# EAGLE design PI_Shield (EAGLE 9.6.2)

## Sheet 1 of 3
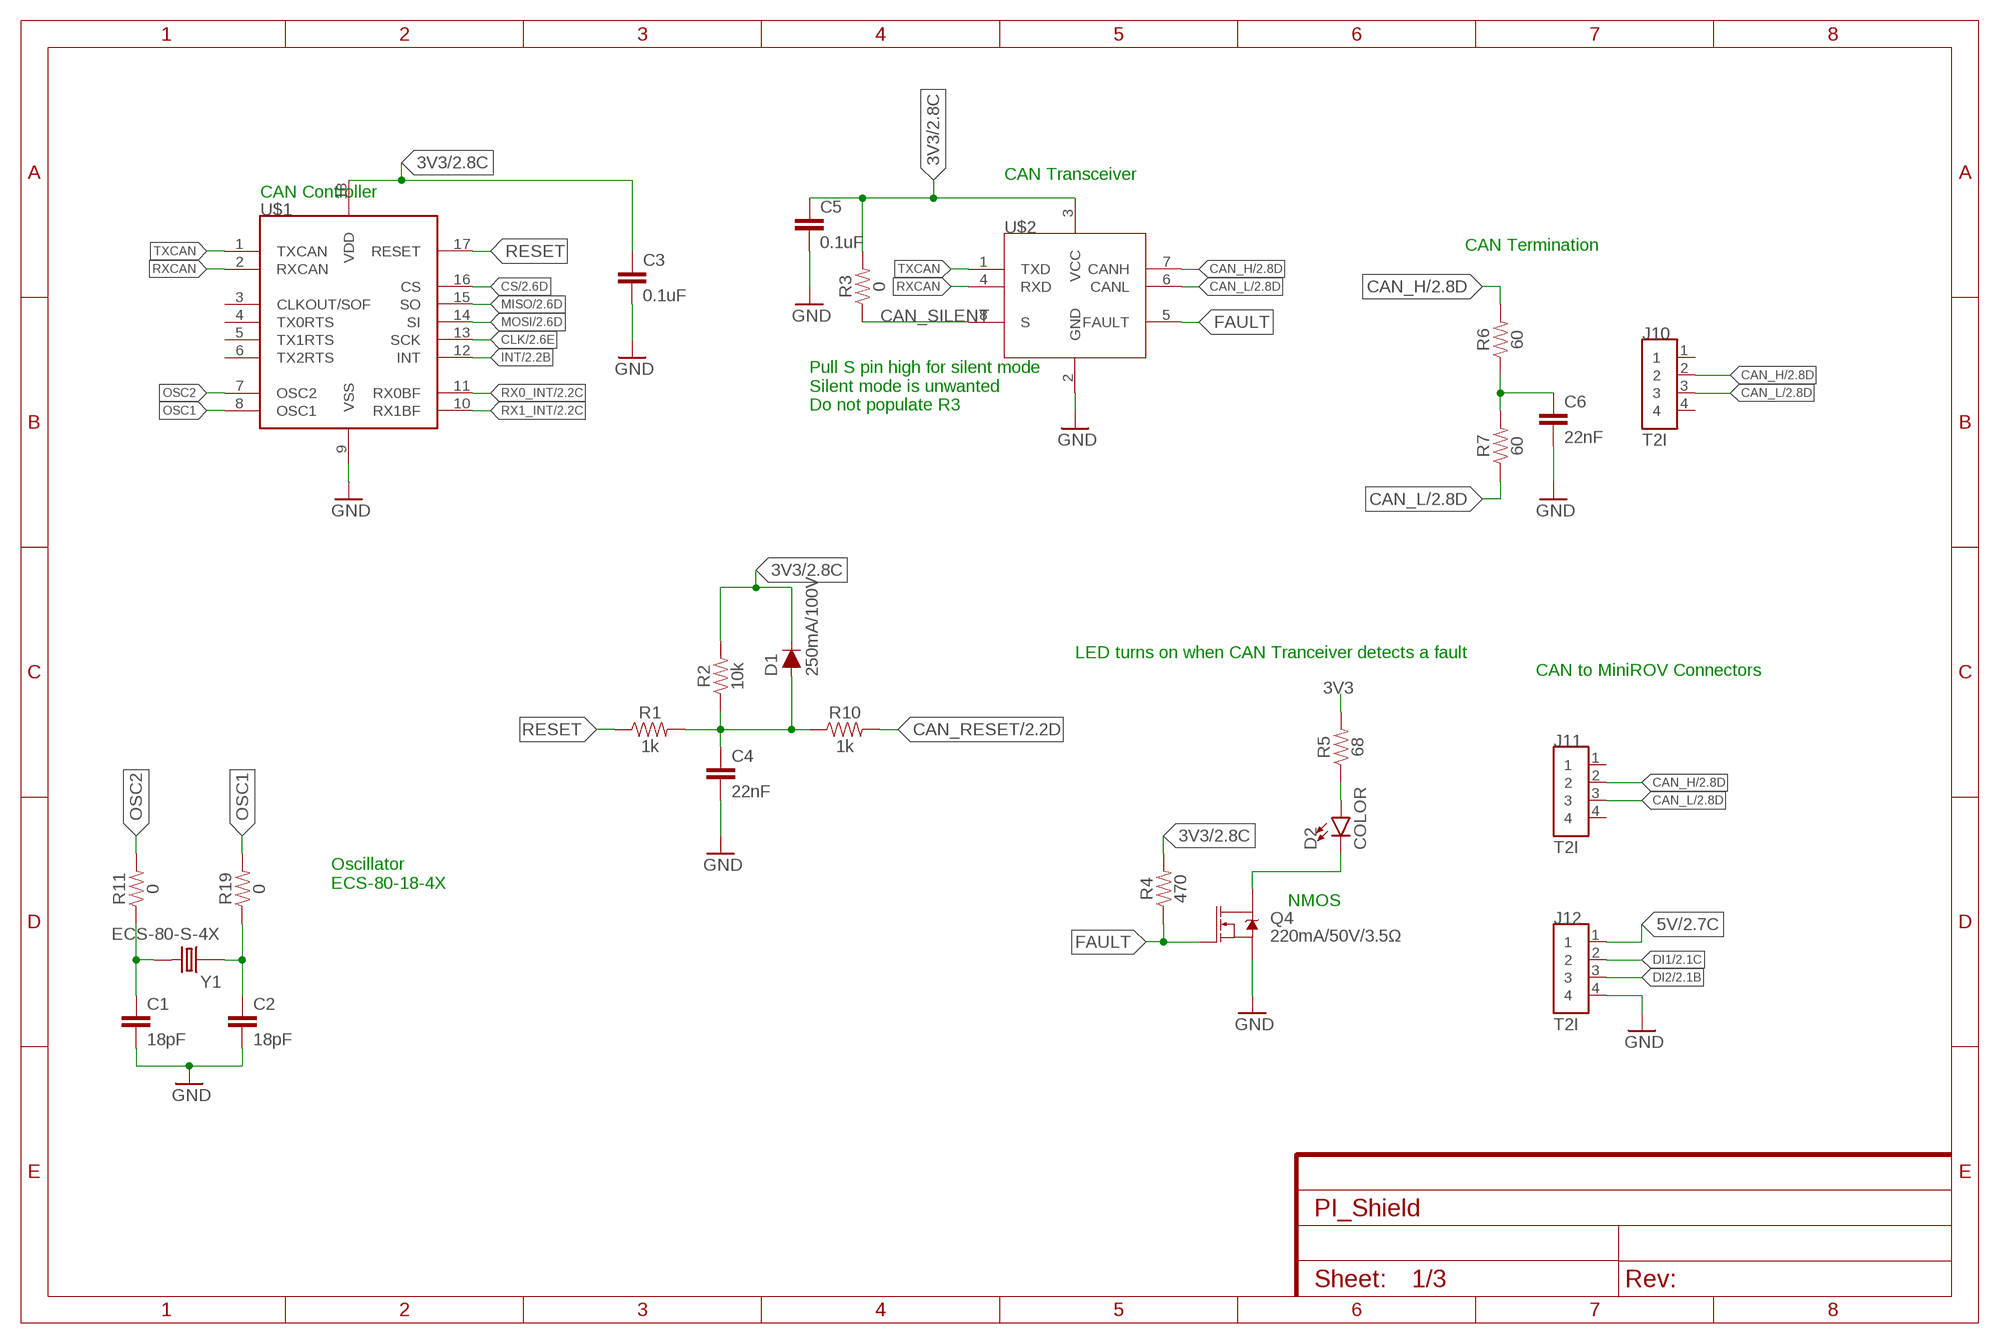
[diagram p0: schematic, sheet 1]

### Parts
C1  18pF  18PF-0603-50V-5%  [0603]
C2  18pF  18PF-0603-50V-5%  [0603]
C3  0.1uF  22NF/22,000PF-0603-50V-10%  [0603]
C4  22nF  22NF/22,000PF-0603-50V-10%  [0603]
C5  0.1uF  22NF/22,000PF-0603-50V-10%  [0603]
C6  22nF  22NF/22,000PF-0603-50V-10%  [0603]
D1  250mA/100V  DIODE-BAS16J  [SOD-323]
D2  COLOR  LED-0805  [0805]
J10  T2I  [T2I]
J11  T2I  [T2I]
J12  T2I  [T2I]
Q4  220mA/50V/3.5Ω  MOSFET-NCH-BSS138  [SOT23-3]
R1  1k  RESISTOR0603  [0603]
R2  10k  RESISTOR0603  [0603]
R3  0  RESISTOR0603  [0603]
R4  470  RESISTOR0603  [0603]
R5  68  RESISTOR0603  [0603]
R6  60  RESISTOR0603  [0603]
R7  60  RESISTOR0603  [0603]
R10  1k  RESISTOR0603  [0603]
R11  0  RESISTOR0603  [0603]
R19  0  RESISTOR0603  [0603]
U$1  MCP2515  [SOIC-18]
U$2  TCAN337D  [SOIC-8]
Y1  ECS-80-S-4X  [XTAL_ECS-80-S-4X]

### Nets
3V3 [3.3V]: C3.1 C5.1 D1.C R2.2 R3.2 R4.2 R5.2 U$1.18(VDD) U$2.3(VCC) ; also sheet 2,3
5V [5V]: J12.1 ; also sheet 2,3
CAN_H [diff pair]: J10.2 J11.2 R6.2 U$2.7(CANH) ; also sheet 2
CAN_L [diff pair]: J10.3 J11.3 R7.1 U$2.6(CANL) ; also sheet 2
CAN_RESET: R10.2 ; also sheet 2
CAN_SILENT: R3.1 U$2.8(S)
CAN_TERM_COM: C6.1 R6.1 R7.2
CLK: U$1.13(SCK) ; also sheet 2
CS: U$1.16(CS) ; also sheet 2
DI1: J12.2 ; also sheet 2
DI2: J12.3 ; also sheet 2
FAULT: Q4.1(G) R4.1 U$2.5(FAULT)
GND: C1.2 C2.2 C3.2 C4.2 C5.2 C6.2 J12.4 Q4.2(S) U$1.9(VSS) U$2.2(GND) ; also sheet 2,3
INT: U$1.12(INT) ; also sheet 2
MISO: U$1.15(SO) ; also sheet 2
MOSI: U$1.14(SI) ; also sheet 2
N$2: C1.1 R11.1 Y1.2
N$3: C2.1 R19.1 Y1.1
N$7: D2.C Q4.3(D)
N$8: D2.A R5.1
OSC1: R19.2 U$1.8(OSC1)
OSC2: R11.2 U$1.7(OSC2)
RESET: R1.1 U$1.17(RESET)
RESET_MID: C4.1 D1.A R1.2 R2.1 R10.1
RX0_INT: U$1.11(RX0BF) ; also sheet 2
RX1_INT: U$1.10(RX1BF) ; also sheet 2
RXCAN: U$1.2(RXCAN) U$2.4(RXD)
TXCAN: U$1.1(TXCAN) U$2.1(TXD)
Unconnected: J10.1 J10.4 J11.1 J11.4 U$1.3(CLKOUT/SOF) U$1.4(TX0RTS) U$1.5(TX1RTS) U$1.6(TX2RTS)

### Notes on the sheet
- CAN Transceiver
- CAN Controller
- CAN Termination
- Pull S pin high for silent mode
  Silent mode is unwanted
  Do not populate R3
- LED turns on when CAN Tranceiver detects a fault
- CAN to MiniROV Connectors
- Oscillator
  ECS-80-18-4X
- NMOS

## Sheet 2 of 3
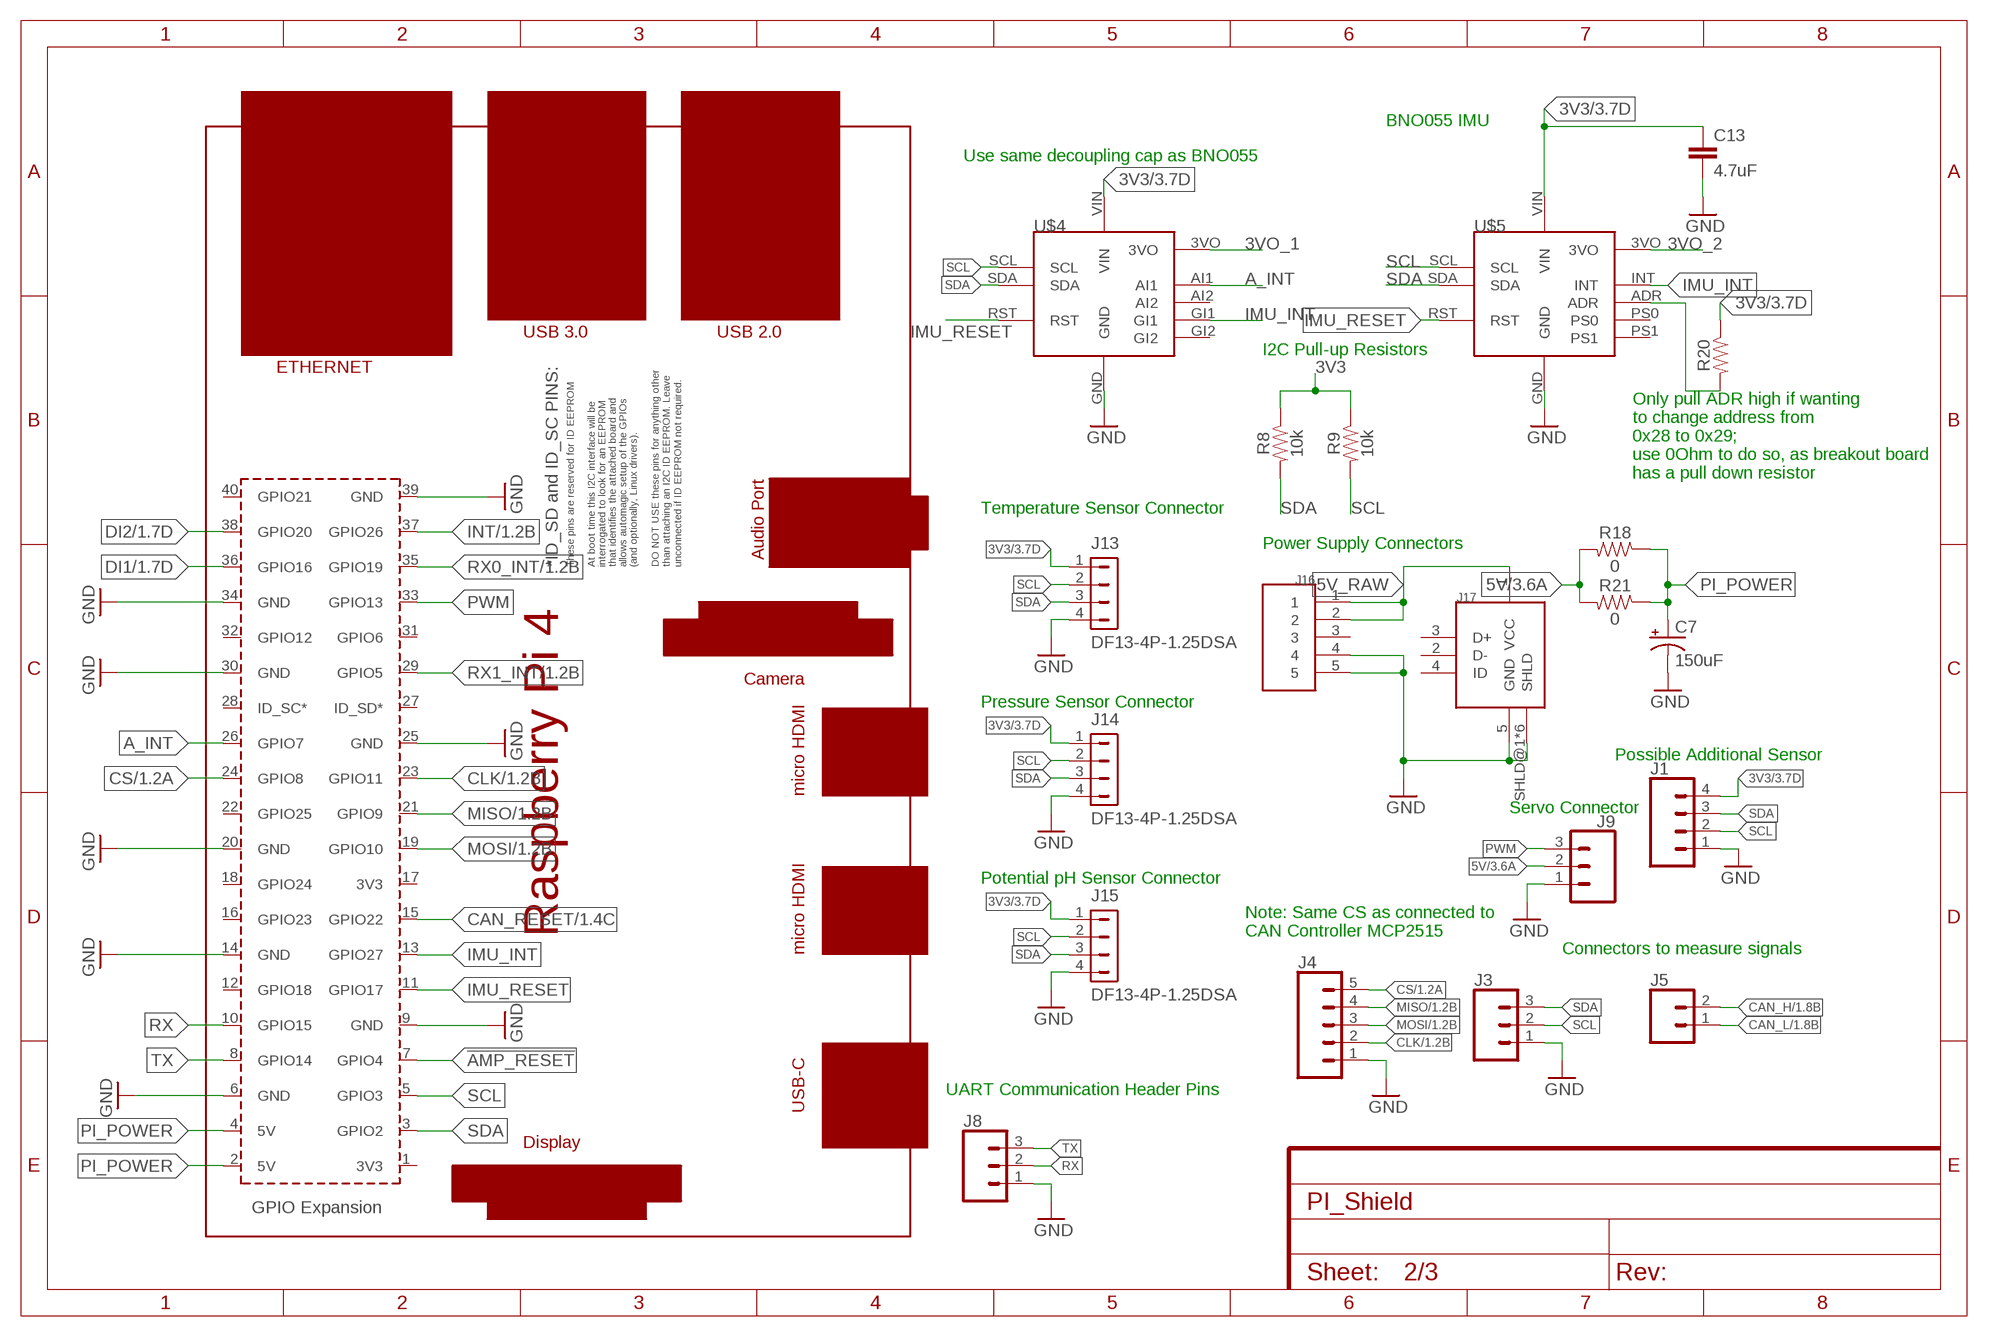
[diagram p1: schematic, sheet 2]

### Parts
C7  150uF  C-TANTALUM(10UF_150UF)  [2917(7343-31-METRIC)]
C13  4.7uF  22NF/22,000PF-0603-50V-10%  [0603]
J1  CONN_04  [1X04]
J3  CONN_03  [1X03]
J4  CONN_05  [1X05]
J5  CONN_02  [1X02]
J8  CONN_03  [1X03]
J9  CONN_03  [1X03]
J13  DF13-4P-1.25DSA  [DF13-4P-1.25DSA]
J14  DF13-4P-1.25DSA  [DF13-4P-1.25DSA]
J15  DF13-4P-1.25DSA  [DF13-4P-1.25DSA]
J16  T2I5P  [T2I5P]
J17  USB-MICRO  [MICRO-USB]
R8  10k  RESISTOR0603  [0603]
R9  10k  RESISTOR0603  [0603]
R18  0  RESISTOR0603  [0603]
R20  RESISTOR0603  [0603]
R21  0  RESISTOR0603  [0603]
U$4  ADAFRUIT-FXOS8700-FXAS21002  [ADAFRUIT-FXOS8700-FXAS21002]
U$5  ADAFRUIT-BNO055  [ADAFRUIT-BNO055]
U$8  RPI4  [RPI4]

### Nets
3V3 [3.3V]: C13.1 J1.4 J13.1 J14.1 J15.1 R8.1 R9.1 R20.1 U$4.VIN U$5.VIN ; also sheet 1,3
3VO_1: U$4.3VO
3VO_2: U$5.3VO
5V [5V]: J9.2 R18.2 R21.2 ; also sheet 1,3
5V_RAW: J16.1 J16.2 J17.1(VCC) ; also sheet 3
!AMP_RESET: U$8.7(GPIO4) ; also sheet 3
A_INT: U$4.AI1 U$8.26(GPIO7)
CAN_H [diff pair]: J5.2 ; also sheet 1
CAN_L [diff pair]: J5.1 ; also sheet 1
CAN_RESET: U$8.15(GPIO22) ; also sheet 1
CLK: J4.2 U$8.23(GPIO11) ; also sheet 1
CS: J4.5 U$8.24(GPIO8) ; also sheet 1
DI1: U$8.36(GPIO16) ; also sheet 1
DI2: U$8.38(GPIO20) ; also sheet 1
GND: C7.- C13.2 J1.1 J3.1 J4.1 J8.1 J9.1 J13.4 J14.4 J15.4 J16.4 J16.5 J17.5(GND) J17.SHLD@1(SHLD) J17.SHLD@2(SHLD) J17.SHLD@3(SHLD) J17.SHLD@4(SHLD) J17.SHLD@5(SHLD) J17.SHLD@6(SHLD) U$4.GND U$5.GND U$8.6(GND) U$8.9(GND) U$8.14(GND) U$8.20(GND) U$8.25(GND) U$8.30(GND) U$8.34(GND) U$8.39(GND) ; also sheet 1,3
IMU_INT: U$4.GI1 U$5.INT U$8.13(GPIO27)
IMU_RESET: U$4.RST U$5.RST U$8.11(GPIO17)
INT: U$8.37(GPIO26) ; also sheet 1
MISO: J4.4 U$8.21(GPIO9) ; also sheet 1
MOSI: J4.3 U$8.19(GPIO10) ; also sheet 1
N$1: R20.2 U$5.ADR
PI_POWER: C7.+ R18.1 R21.1 U$8.2(5V) U$8.4(5V)
PWM: J9.3 U$8.33(GPIO13)
RX: J8.2 U$8.10(GPIO15)
RX0_INT: U$8.35(GPIO19) ; also sheet 1
RX1_INT: U$8.29(GPIO5) ; also sheet 1
SCL: J1.2 J3.2 J13.2 J14.2 J15.2 R9.2 U$4.SCL U$5.SCL U$8.5(GPIO3) ; also sheet 3
SDA: J1.3 J3.3 J13.3 J14.3 J15.3 R8.2 U$4.SDA U$5.SDA U$8.3(GPIO2) ; also sheet 3
TX: J8.3 U$8.8(GPIO14)
Unconnected: J16.3 J17.2(D-) J17.3(D+) J17.4(ID) U$4.AI2 U$4.GI2 U$5.PS0 U$5.PS1 U$8.1(3V3) U$8.12(GPIO18) U$8.16(GPIO23) U$8.17(3V3) U$8.18(GPIO24) U$8.22(GPIO25) U$8.27(ID_SD*) U$8.28(ID_SC*) U$8.31(GPIO6) U$8.32(GPIO12) U$8.40(GPIO21)

### Notes on the sheet
- BNO055 IMU
- Use same decoupling cap as BNO055
- I2C Pull-up Resistors
- Only pull ADR high if wanting
  to change address from
  0x28 to 0x29;
  use 0Ohm to do so, as breakout board
  has a pull down resistor
- Temperature Sensor Connector
- Power Supply Connectors
- Pressure Sensor Connector
- Possible Additional Sensor
- Servo Connector
- Potential pH Sensor Connector
- Note: Same CS as connected to 
  CAN Controller MCP2515
- Connectors to measure signals
- UART Communication Header Pins

## Sheet 3 of 3
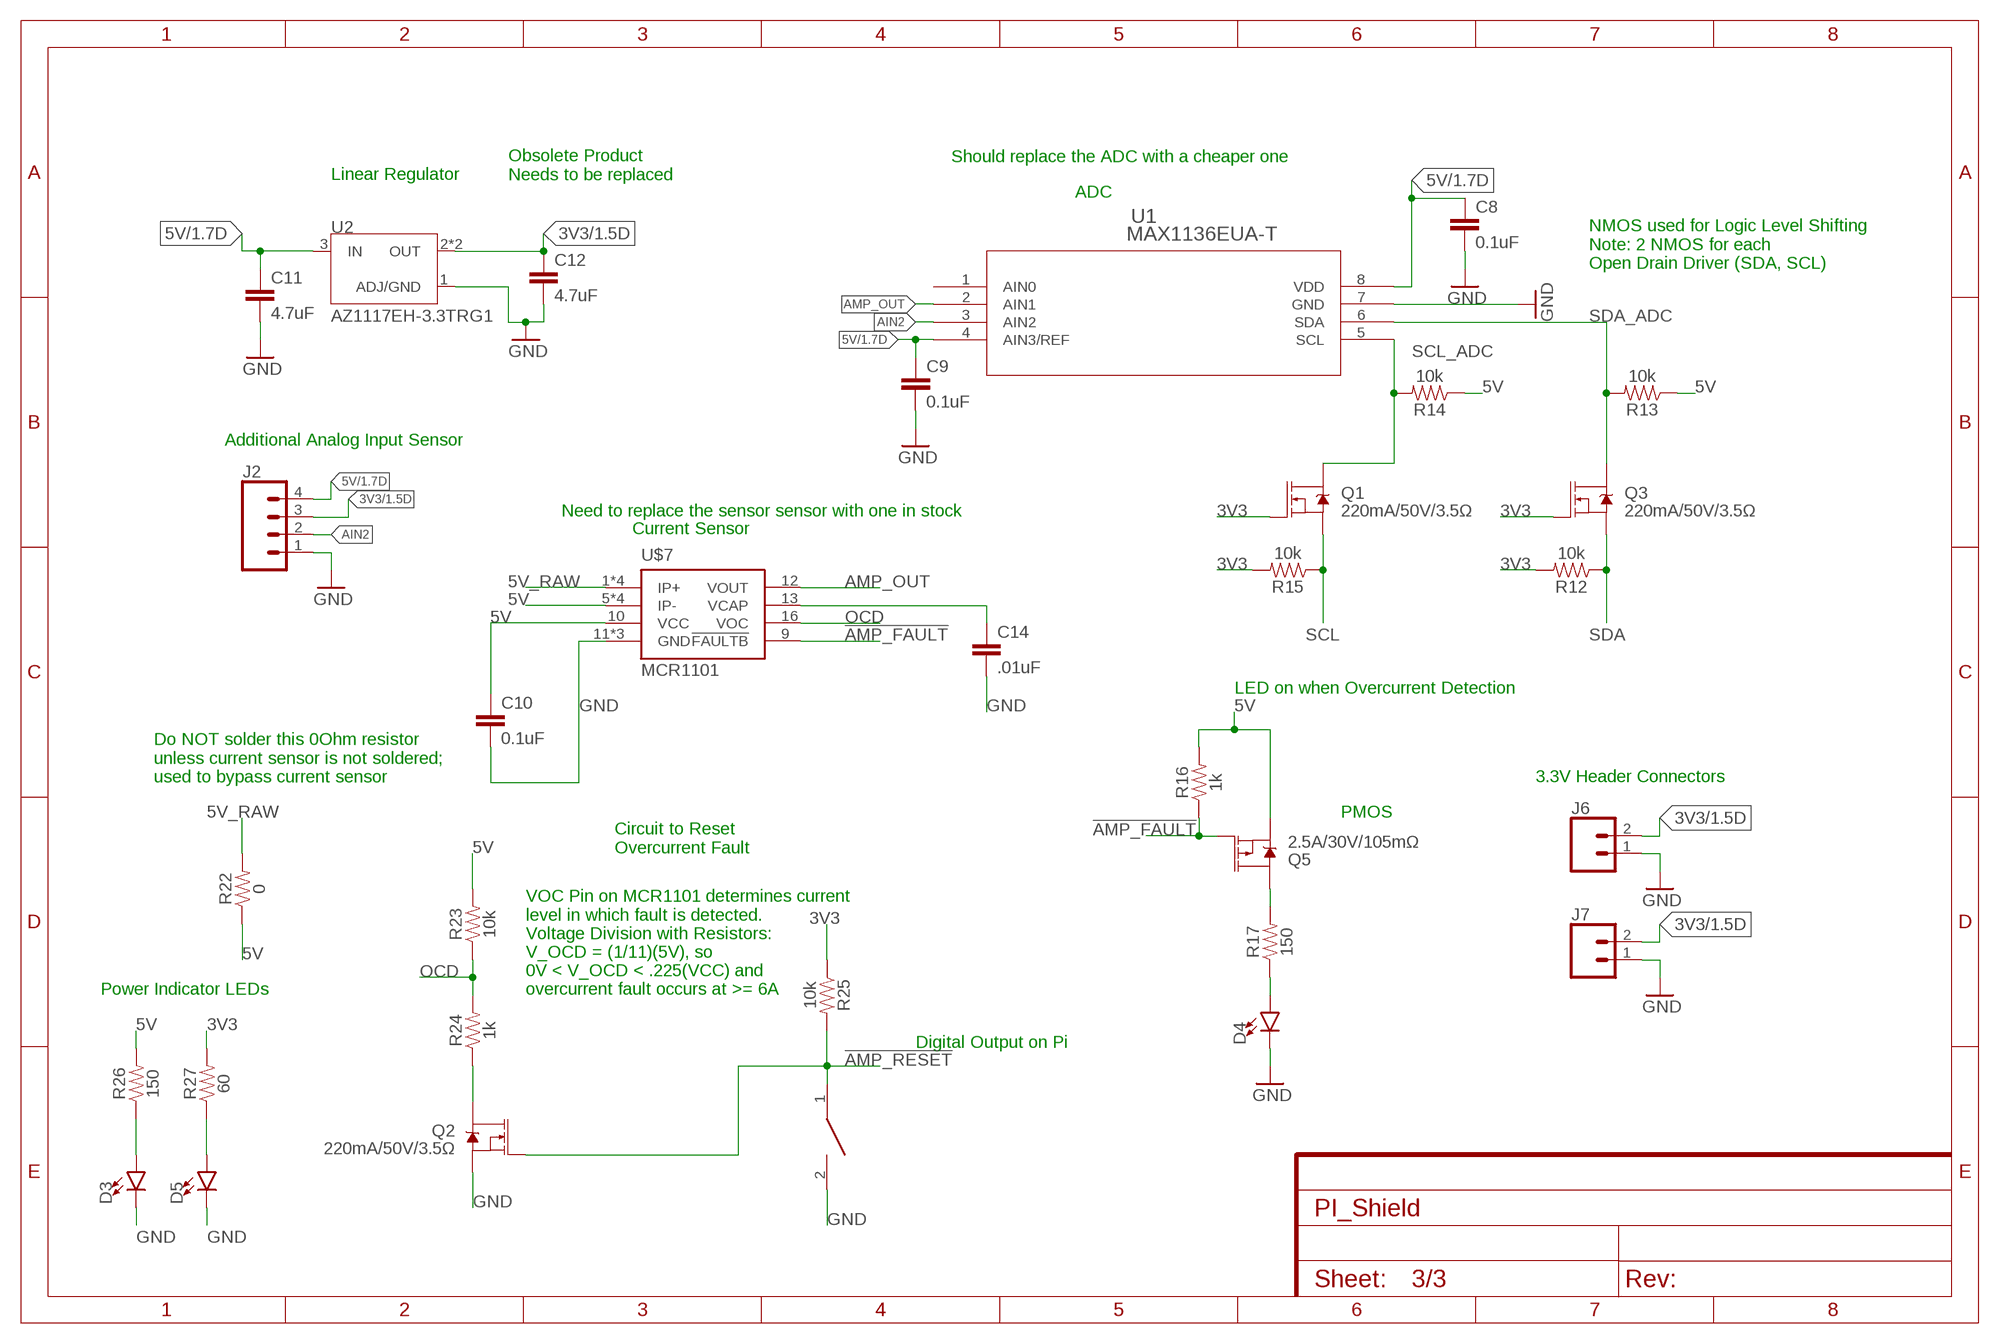
[diagram p2: schematic, sheet 3]

### Parts
C8  0.1uF  22NF/22,000PF-0603-50V-10%  [0603]
C9  0.1uF  22NF/22,000PF-0603-50V-10%  [0603]
C10  0.1uF  22NF/22,000PF-0603-50V-10%  [0603]
C11  4.7uF  22NF/22,000PF-0603-50V-10%  [0603]
C12  4.7uF  22NF/22,000PF-0603-50V-10%  [0603]
C14  .01uF  22NF/22,000PF-0603-50V-10%  [0603]
D3  LED0603  [LED-0603]
D4  LED0603  [LED-0603]
D5  LED0603  [LED-0603]
J2  CONN_04  [1X04]
J6  CONN_02  [1X02]
J7  CONN_02  [1X02]
Q1  220mA/50V/3.5Ω  MOSFET-NCH-BSS138  [SOT23-3]
Q2  220mA/50V/3.5Ω  MOSFET-NCH-BSS138  [SOT23-3]
Q3  220mA/50V/3.5Ω  MOSFET-NCH-BSS138  [SOT23-3]
Q5  2.5A/30V/105mΩ  MOSFET_PCH-DMG2307L  [SOT23-3]
R12  10k  RESISTOR0603  [0603]
R13  10k  RESISTOR0603  [0603]
R14  10k  RESISTOR0603  [0603]
R15  10k  RESISTOR0603  [0603]
R16  1k  RESISTOR0603  [0603]
R17  150  RESISTOR0603  [0603]
R22  0  RESISTOR0603  [0603]
R23  10k  RESISTOR0603  [0603]
R24  1k  RESISTOR0603  [0603]
R25  10k  RESISTOR0603  [0603]
R26  150  RESISTOR0603  [0603]
R27  60  RESISTOR0603  [0603]
U1  MAX1136EUA-T  [21-0036K]
U2  AZ1117EH-3.3TRG1  [SOT230P700X180-4N]
U$6  DISCRETECOMPONENTS_SWITCH  [DISCRETECOMPONENTS_SW_2512]
U$7  MCR1101  [SOIC-16]

### Nets
3V3 [3.3V]: C12.1 J2.3 J6.2 J7.2 Q1.1(G) Q3.1(G) R12.2 R15.2 R25.1 R27.2 U2.2(OUT) U2.4(OUT) ; also sheet 1,2
5V [5V]: C8.1 C9.1 C10.1 C11.1 J2.4 Q5.2(S) R13.1 R14.1 R16.2 R22.1 R23.2 R26.2 U1.4(AIN3/REF) U1.8(VDD) U2.3(IN) U$7.5(IP-) U$7.6(IP-) U$7.7(IP-) U$7.8(IP-) U$7.10(VCC) ; also sheet 1,2
5V_RAW: R22.2 U$7.1(IP+) U$7.2(IP+) U$7.3(IP+) U$7.4(IP+) ; also sheet 2
!AMP_FAULT: Q5.1(G) R16.1 U$7.9(!FAULTB)
!AMP_RESET: Q2.1(G) R25.2 U$6.1 ; also sheet 2
AIN2: J2.2 U1.3(AIN2)
AMP_OUT: U1.2(AIN1) U$7.12(VOUT)
GND: C8.2 C9.2 C10.2 C11.2 C12.2 C14.2 D3.C D4.C D5.C J2.1 J6.1 J7.1 Q2.2(S) U1.7(GND) U2.1(ADJ/GND) U$6.2 U$7.11(GND) U$7.14(GND) U$7.15(GND) ; also sheet 1,2
N$6: C14.1 U$7.13(VCAP)
N$9: D3.A R26.1
N$10: Q5.3(D) R17.2
N$11: D4.A R17.1
N$12: D5.A R27.1
N$13: Q2.3(D) R24.1
OCD: R23.1 R24.2 U$7.16(VOC)
SCL: Q1.2(S) R15.1 ; also sheet 2
SCL_ADC: Q1.3(D) R14.2 U1.5(SCL)
SDA: Q3.2(S) R12.1 ; also sheet 2
SDA_ADC: Q3.3(D) R13.2 U1.6(SDA)
Unconnected: U1.1(AIN0)

### Notes on the sheet
- Should replace the ADC with a cheaper one
- Linear Regulator
- Obsolete Product
  Needs to be replaced
- ADC
- NMOS used for Logic Level Shifting
  Note: 2 NMOS for each 
  Open Drain Driver (SDA, SCL)
- Additional Analog Input Sensor
- Need to replace the sensor sensor with one in stock
- Current Sensor
- LED on when Overcurrent Detection
- Do NOT solder this 0Ohm resistor
  unless current sensor is not soldered;
  used to bypass current sensor
- 3.3V Header Connectors
- PMOS
- Circuit to Reset
  Overcurrent Fault
- Power Indicator LEDs
- VOC Pin on MCR1101 determines current
  level in which fault is detected.
  Voltage Division with Resistors:
  V_OCD = (1/11)(5V), so
  0V < V_OCD < .225(VCC) and
  overcurrent fault occurs at >= 6A
- Digital Output on Pi

## Library data of the parts
C1 C2 = SparkFun-Capacitors:18PF: 18pF ceramic capacitors A capacitor is a passive two-terminal electrical component used to store electrical energy temporarily in an electric field.; PROD_ID: CAP-08267
C3 C5 C8-C14 = SparkFun-Capacitors:22NF/22,000PF: 0.022uF/22nF/22,000pF ceramic capacitors A capacitor is a passive two-terminal electrical component used to store electrical energy temporarily in an electric field.; PROD_ID: CAP-07885; VALUE: 22nF
C4 C6 = SparkFun-Capacitors:22NF/22,000PF: 0.022uF/22nF/22,000pF ceramic capacitors A capacitor is a passive two-terminal electrical component used to store electrical energy temporarily in an electric field.; PROD_ID: CAP-07885
C7 = Tantalum Cap 150 uF - Kemet 2917 T491:C-TANTALUM(10UF_150UF)
D1 = SparkFun-DiscreteSemi:DIODE: Diode These are standard reverse protection diodes and small signal diodes. SparkFun Products: SparkFun SparkPunk Sound Kit <https://www.sparkfun.com/products/11177> SparkFun ESP8266 Thing <https://www.sparkfun.com/products/13231>; PROD_ID: DIO-09646
D2 = LED-0805:LED-0805
D3-D5 = SparkFun-LED:LED: LED (Generic) Standard schematic elements and footprints for 5mm, 3mm, 1206, and 0603 sized LEDs. Generic LEDs with no color specified.
J1 J2 = SparkFun-Connectors:CONN_04: Multi connection point. Often used as Generic Header-pin footprint for 0.1 inch spaced/style header connections On any of the 0.1 inch spaced packages, you can populate with these: Break Away Headers - Straight <https://www.sparkfun.com/products/116> (PRT-00116) Break Away Male Headers - Right Angle <https://www.sparkfun.com/products/553> (PRT-00553) Female Headers <https://www.sparkfun.com/products/115> (PRT-00115) Break Away Headers - Machine Pin <https://www.sparkfun.com/products/117> (PRT-00117) Break Away Female Headers - Swiss Machine Pin <https://www.sparkfun.com/products/743> (PRT-00743) For SCREWTERMINALS and SPRING TERMINALS visit here: Screw Terimnals on SparkFun.com <https://www.sparkfun.com/search/results?term=Screw+Terminals> (5mm/3.5mm/2.54mm spacing) This device is also useful as a general connection point to wire up your design to another part of your project. Our various solder wires solder well into these plated through hole pads. Hook-Up Wire - Assortment (Stranded, 22 AWG) <https://www.sparkfun.com/products/11375> (PRT-11375) Hook-Up Wire - Assortment (Solid Core, 22 AWG) <https://www.sparkfun.com/products/11367> (PRT-11367) View the entire wire category on our website here <https://www.sparkfun.com/categories/141> Special notes: Molex polarized connector foot print use with SKU : PRT-08231 with associated crimp pins and housings. 1MM SMD Version SKU: PRT-10208; PROD_ID: CONN-09696
J3 J8 J9 = SparkFun-Connectors:CONN_03: Multi connection point. Often used as Generic Header-pin footprint for 0.1 inch spaced/style header connections On any of the 0.1 inch spaced packages, you can populate with these: Break Away Headers - Straight <https://www.sparkfun.com/products/116> (PRT-00116) Break Away Male Headers - Right Angle <https://www.sparkfun.com/products/553> (PRT-00553) Female Headers <https://www.sparkfun.com/products/115> (PRT-00115) Break Away Headers - Machine Pin <https://www.sparkfun.com/products/117> (PRT-00117) Break Away Female Headers - Swiss Machine Pin <https://www.sparkfun.com/products/743> (PRT-00743) Stackable Header - 3 Pin (Female, 0.1") <https://www.sparkfun.com/products/13875> (PRT-13875) For SCREWTERMINALS and SPRING TERMINALS visit here: Screw Terimnals on SparkFun.com <https://www.sparkfun.com/search/results?term=Screw+Terminals> (5mm/3.5mm/2.54mm spacing) This device is also useful as a general connection point to wire up your design to another part of your project. Our various solder wires solder well into these plated through hole pads. Hook-Up Wire - Assortment (Stranded, 22 AWG) <https://www.sparkfun.com/products/11375> (PRT-11375) Hook-Up Wire - Assortment (Solid Core, 22 AWG) <https://www.sparkfun.com/products/11367> (PRT-11367) View the entire wire category on our website here <https://www.sparkfun.com/categories/141> Special notes: Molex polarized connector foot print use with SKU : PRT-08232 with associated crimp pins and housings.
J4 = SparkFun-Connectors:CONN_05: Multi connection point. Often used as Generic Header-pin footprint for 0.1 inch spaced/style header connections On any of the 0.1 inch spaced packages, you can populate with these: Break Away Headers - Straight <https://www.sparkfun.com/products/116> (PRT-00116) Break Away Male Headers - Right Angle <https://www.sparkfun.com/products/553> (PRT-00553) Female Headers <https://www.sparkfun.com/products/115> (PRT-00115) Break Away Headers - Machine Pin <https://www.sparkfun.com/products/117> (PRT-00117) Break Away Female Headers - Swiss Machine Pin <https://www.sparkfun.com/products/743> (PRT-00743) For SCREWTERMINALS and SPRING TERMINALS visit here: Screw Terimnals on SparkFun.com <https://www.sparkfun.com/search/results?term=Screw+Terminals> (5mm/3.5mm/2.54mm spacing) This device is also useful as a general connection point to wire up your design to another part of your project. Our various solder wires solder well into these plated through hole pads. Hook-Up Wire - Assortment (Stranded, 22 AWG) <https://www.sparkfun.com/products/11375> (PRT-11375) Hook-Up Wire - Assortment (Solid Core, 22 AWG) <https://www.sparkfun.com/products/11367> (PRT-11367) View the entire wire category on our website here <https://www.sparkfun.com/categories/141> Special notes: Molex polarized connector foot print use with SKU : PRT-08231 with associated crimp pins and housings. 1MM SMD Version SKU: PRT-10208
J5-J7 = SparkFun-Connectors:CONN_02: Multi connection point. Often used as Generic Header-pin footprint for 0.1 inch spaced/style header connections On any of the 0.1 inch spaced packages, you can populate with these: Break Away Headers - Straight <https://www.sparkfun.com/products/116> (PRT-00116) Break Away Male Headers - Right Angle <https://www.sparkfun.com/products/553> (PRT-00553) Female Headers <https://www.sparkfun.com/products/115> (PRT-00115) Break Away Headers - Machine Pin <https://www.sparkfun.com/products/117> (PRT-00117) Break Away Female Headers - Swiss Machine Pin <https://www.sparkfun.com/products/743> (PRT-00743) For SCREWTERMINALS and SPRING TERMINALS visit here: Screw Terimnals on SparkFun.com <https://www.sparkfun.com/search/results?term=Screw+Terminals> (5mm/3.5mm/2.54mm spacing) This device is also useful as a general connection point to wire up your design to another part of your project. Our various solder wires solder well into these plated through hole pads. Hook-Up Wire - Assortment (Stranded, 22 AWG) <https://www.sparkfun.com/products/11375> (PRT-11375) Hook-Up Wire - Assortment (Solid Core, 22 AWG) <https://www.sparkfun.com/products/11367> (PRT-11367) View the entire wire category on our website here <https://www.sparkfun.com/categories/141> Special notes: Molex polarized connector foot print use with: PRT-08233 with associated crimp pins and housings. 2.54_SCREWTERM for use with PRT-10571. 3.5mm Screw Terminal footprints for PRT-08084 5mm Screw Terminal footprints for use with PRT-08432
J10-J12 = Samtec t2i:T2I
J13-J15 = con-hirose-df13:DF13-4P-1.25: DF13-4P 1.25mm Pitch Miniature Crimping Connector.
J16 = Samtec t2i:T2I5P
J17 = usb conn:USB-MICRO: Footprint for specific microUSB connector. Manufacturer: GCT. Manufacturer Product Number: USB3075-30-A. Digikey Link: https://www.digikey.com/en/products/detail/gct/USB3075-30-A/9859705
Q1-Q4 = SparkFun-DiscreteSemi:MOSFET-NCH: N-channel MOSFETs Voltage controlled devices that allow control of high current outputs. SparkFun Products: SparkFun OpenScale <https://www.sparkfun.com/products/13261> SparkFun Digital Sandbox <https://www.sparkfun.com/products/12651> SparkFun Monster Moto Shield <https://www.sparkfun.com/products/10182> SparkFun MOSFET Power Controller <https://www.sparkfun.com/products/11214>; PROD_ID: TRANS-00830
Q5 = SparkFun-DiscreteSemi:MOSFET_PCH: P-channel MOSFETs Voltage controlled devices that allow control of high current outputs. SparkFun Products: SparkFun ESP32 Thing <https://www.sparkfun.com/products/13907> SparkFun ESP8266 Thing <https://www.sparkfun.com/products/13231>; PROD_ID: TRANS-11308
R1-R27 = SparkFun-Resistors:RESISTOR: Generic Resistor Package
U1 = MAX1136EUA-T:MAX1136EUA-T; DESCRIPTION: 2.7V to 3.6V and 4.5V to 5.5V, Low-Power, 4-/12-Channel, 2-Wire Serial 10-Bit AD; DIGI-KEY_PART_NUMBER: MAX1136EUA+-ND; DIGI-KEY_PURCHASE_URL: https://www.digikey.com/product-detail/en/maxim-integrated/MAX1136EUA-/MAX1136EUA--ND/1159953?utm_source=snapeda&utm_medium=aggregator&utm_campaign=symbol; MF: Maxim Integrated; MP: MAX1136EUA+; PACKAGE: MSOP-8 Maxim Integrated
U2 = AZ1117EH-3.3TRG1:AZ1117EH-3.3TRG1: Ldo.Vreg Pos 3, 3v 1a Sot223; AVAILABILITY: Unavailable; DESCRIPTION: Ldo.Vreg Pos 3, 3v 1a Sot223; MF: Diodes Inc.; MP: AZ1117EH-3.3TRG1; PACKAGE: SOT-223 Diodes Inc.; PRICE: None
U$1 = STM and CAN parts:MCP2515
U$2 = STM and CAN parts:TCAN337D
U$4 = Adafruit IMUs - BNO055 and FX:ADAFRUIT-FXOS8700-FXAS21002
U$5 = Adafruit IMUs - BNO055 and FX:ADAFRUIT-BNO055
U$6 = Push button - FSM2JMTR:DISCRETECOMPONENTS_SWITCH: TE Connectivity FSM2JMTR Switch
U$7 = MCR1101:MCR1101
U$8 = RaspberryPi:RPI4
Y1 = ECS-80-S-4X:ECS-80-S-4X: CRYSTAL T/H; DESCRIPTION: Crystal 8MHz Series 2-Pin HC-49/U; DIGI-KEY_PART_NUMBER: X1057-ND; DIGI-KEY_PURCHASE_URL: https://www.digikey.com/product-detail/en/ecs-inc/ECS-80-S-4X/X1057-ND/827549?utm_source=snapeda&utm_medium=aggregator&utm_campaign=symbol; MF: ECS International; MP: ECS-80-S-4X; PACKAGE: HC-49/US ECS International

## Net classes
0 default: width 0.203 mm
1 diff pair: width 0.203 mm, clearance 0.203 mm
2 5V: width 0.508 mm
3 3.3V: width 0.508 mm

## Board
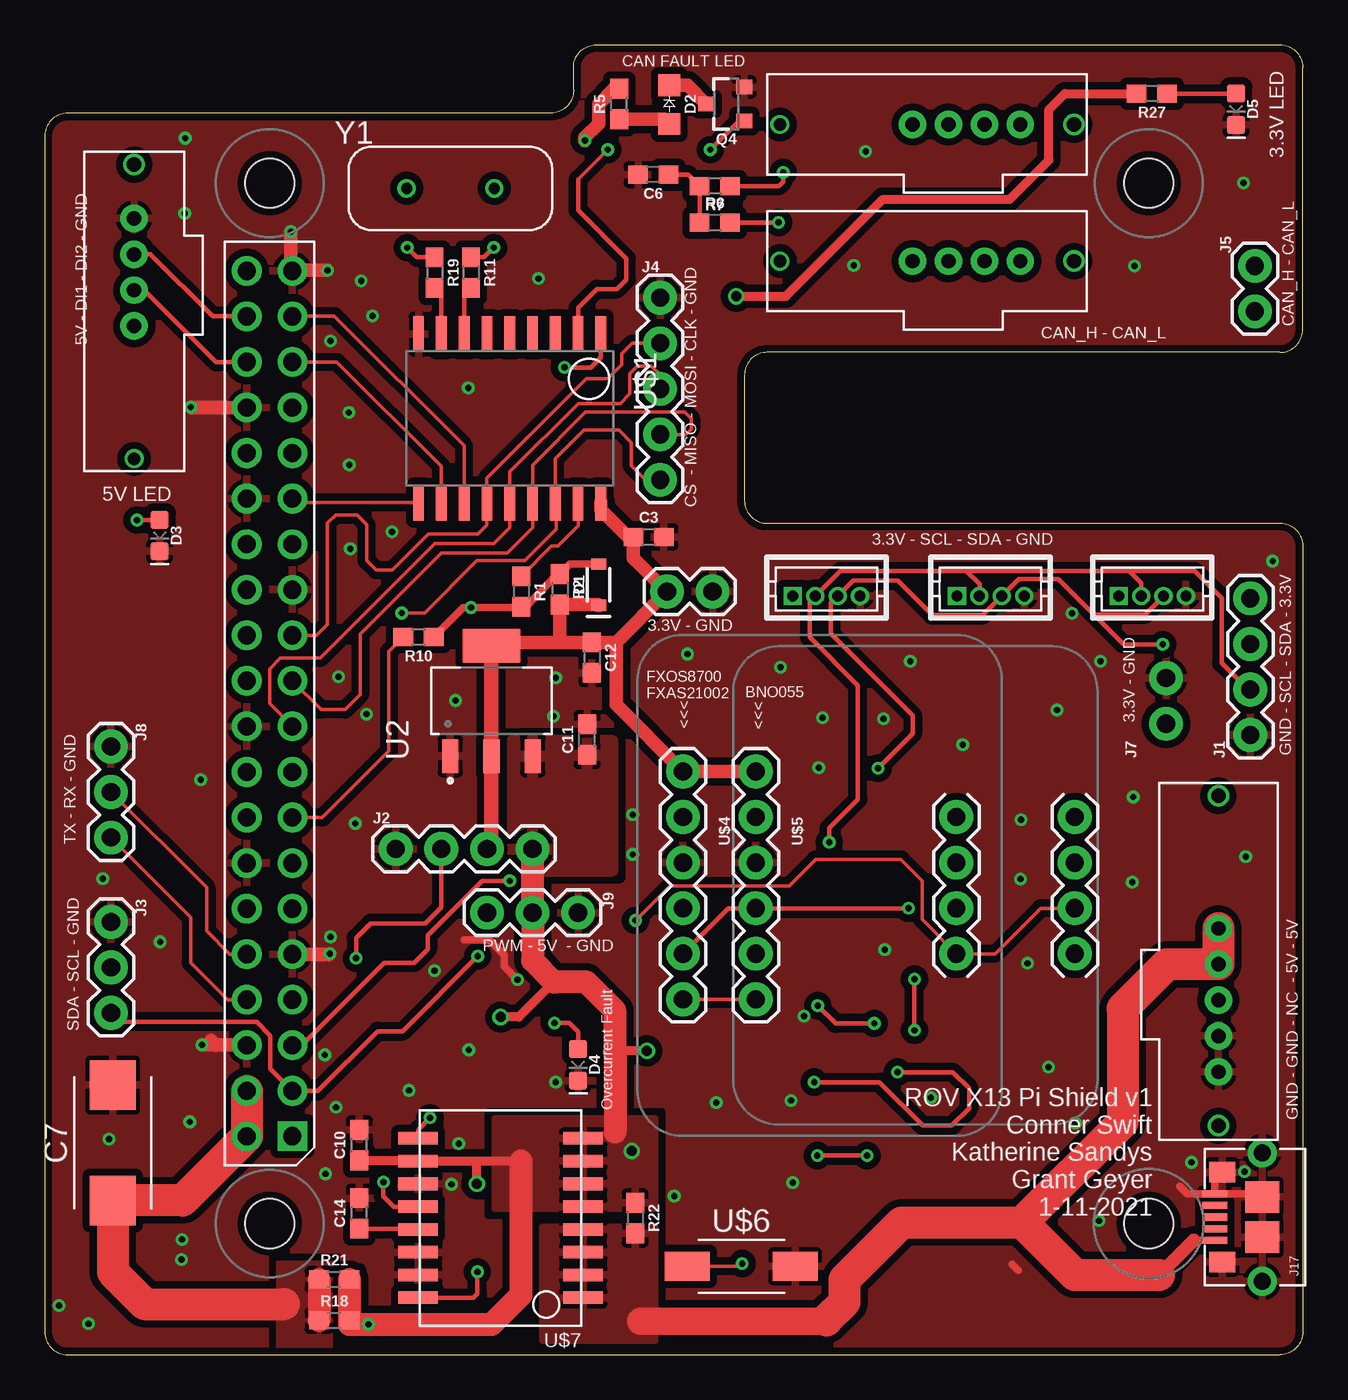
[diagram p3: board, top side]
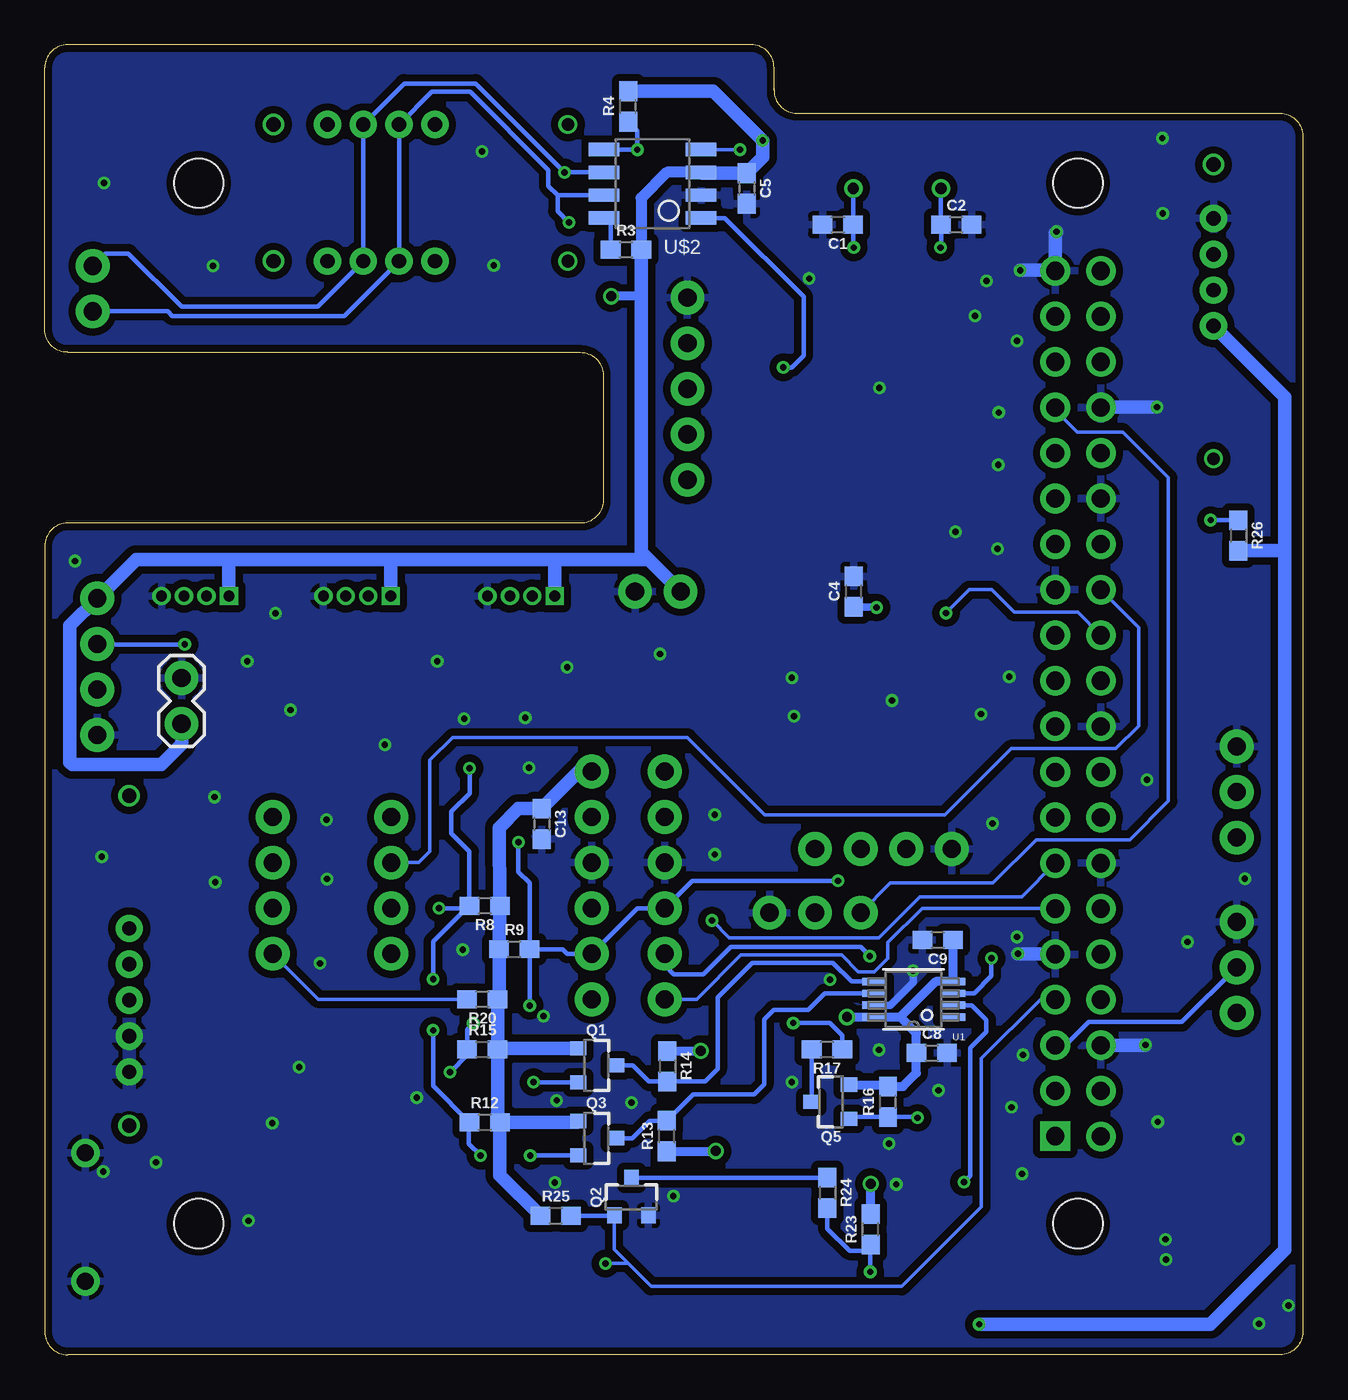
[diagram p4: board, bottom side, seen from below]

Size 70.1 x 73.03 mm. Coordinates in mm from the lower left corner, seen from the top.
Outline: 70.1,45.09 70.1,1.27 arc-90 68.83,0 1.27,0 arc-90 0,1.27 0,67.94 arc-90 1.27,69.22 28.19,69.22 arc90 29.46,70.48 29.46,71.75 arc-90 30.73,73.03 68.83,73.03 arc-90 70.1,71.75 70.1,57.15 arc-90 68.83,55.88 40.26,55.88 arc90 38.99,54.61 38.99,47.62 arc90 40.26,46.35 68.83,46.35 arc-90 70.1,45.09
Copper layers (1*16): Top 0.0356mm / dielectric 1.5011mm / Bottom 0.0356mm
Design rules "ECE477": minimum track width 8mil, minimum drill 13mil, track to track 8mil, track to pad 8mil, pad to pad 6mil, via to via 8mil, smd to smd 6mil, copper to edge 15mil, drill to drill 8mil, minimum pad ring 7mil, minimum via ring 7mil, stop-mask expansion 3mil, vias tented up to drill 0mil, thermal gap 10mil

### Footprints (pad centres in the part's own frame; a part is rotated, then mirrored left to right if it is on the bottom)
0603 = smd 1.1 x 1: 1 -0.85,0; 2 0.85,0
2917(7343-31-METRIC) = smd 2.77 x 2.55: + -3.22,0; - 3.22,0
SOD-323 = smd 0.63 x 0.83: A 1.15,0; C -1.15,0
0805 = smd 1.2 x 1.2: A 1.1,0; C -1.05,0
LED-0603 = smd 1 x 1: A -0.877,0; C 0.877,0
1X04 = drill 1.016 pad 1.88: 1 0,0; 2 2.54,0; 3 5.08,0; 4 7.62,0
1X03 = drill 1.016 pad 1.88: 1 0,0; 2 2.54,0; 3 5.08,0
1X05 = drill 1.016 pad 1.88: 1 0,0; 2 2.54,0; 3 5.08,0; 4 7.62,0; 5 10.16,0
1X02 = drill 1.016 pad 1.88: 1 0,0; 2 2.54,0
T2I = drill 0.8 pad 1.524: 1 8.1,2.8; 2 10.1,2.8; 3 12.1,2.8; 4 14.1,2.8 | drill 0.7: S1 0.7,2.8 | drill 0.8: S2 17.1,2.8
DF13-4P-1.25DSA = drill 0.6 pad 1.016 square: 1 1.875,0 | drill 0.6 pad 1.016: 2 0.625,0; 3 -0.625,0; 4 -1.875,0
T2I5P = drill 0.8 pad 1.524: 1 -11.7,3.3; 2 -9.7,3.3; 3 -7.7,3.3; 4 -5.7,3.3; 5 -3.7,3.3 | drill 0.8: P$1 -19.1,3.3; P$7 -0.7,3.3
MICRO-USB = smd 0.4 x 1.4: 1 -1.3,2.65; 2 -0.65,2.65; 3 0,2.65; 4 0.65,2.65; 5 1.3,2.65 | smd 1.75 x 1.9: SHLD@1 -1.125,0; SHLD@2 1.125,0 | drill 0.95 pad 1.6: SHLD@3 -3.575,0; SHLD@4 3.575,0 | smd 1.15 x 1.45: SHLD@5 -2.5,2.23; SHLD@6 2.5,2.23
SOT23-3 = smd 0.8 x 0.9: 1 -0.95,-1; 2 0.95,-1; 3 0,1.1
21-0036K = smd 1.372 x 0.406: 1 -2.184,0.991; 2 -2.184,0.33; 3 -2.184,-0.33; 4 -2.184,-0.991; 5 2.184,-0.991; 6 2.184,-0.33; 7 2.184,0.33; 8 2.184,0.991
SOT230P700X180-4N = smd 1.86 x 0.9: 1 -3.075,2.3; 2 -3.075,0; 3 -3.075,-2.3 | smd 1.86 x 3.19: 4 3.075,0
SOIC-18 = smd 2 x 0.6: 1 0,10.16; 2 0,8.89; 3 0,7.62; 4 0,6.35; 5 0,5.08; 6 0,3.81; 7 0,2.54; 8 0,1.27; 9 0,0; 10 9.4,0; 11 9.4,1.27; 12 9.4,2.54; 13 9.4,3.81; 14 9.4,5.08; 15 9.4,6.35; 16 9.4,7.62; 17 9.4,8.89; 18 9.4,10.16
SOIC-8 = smd 1.7 x 0.75: 1 0,3.81; 2 0,2.54; 3 0,1.27; 4 0,0; 5 5.4,0; 6 5.4,1.27; 7 5.4,2.54; 8 5.4,3.81
ADAFRUIT-FXOS8700-FXAS21002 = drill 1.016 pad 1.88: 3VO 10.16,2.54; AI1 12.7,17.78; AI2 10.16,17.78; GI1 17.78,17.78; GI2 15.24,17.78; GND 12.7,2.54; RST 20.32,2.54; SCL 15.24,2.54; SDA 17.78,2.54; VIN 7.62,2.54
ADAFRUIT-BNO055 = drill 1.016 pad 1.88: 3VO 9.525,1.27; ADR 17.145,19.05; GND 12.065,1.27; INT 14.605,19.05; PS0 9.525,19.05; PS1 12.065,19.05; RST 19.685,1.27; SCL 17.145,1.27; SDA 14.605,1.27; VIN 6.985,1.27
DISCRETECOMPONENTS_SW_2512 = smd 2.5 x 1.6: 1 -3,0; 2 3,0
SOIC-16 = smd 2.2 x 0.7: 1 -4.6,4.445; 2 -4.6,3.175; 3 -4.6,1.905; 4 -4.6,0.635; 5 -4.6,-0.635; 6 -4.6,-1.905; 7 -4.6,-3.175; 8 -4.6,-4.445; 9 4.6,-4.445; 10 4.6,-3.175; 11 4.6,-1.905; 12 4.6,-0.635; 13 4.6,0.635; 14 4.6,1.905; 15 4.6,3.175; 16 4.6,4.445
RPI4 = drill 1.016 pad 1.651 square: 1 8.37,51.23 | drill 1.016 pad 1.651: 2 8.357,53.772; 3 10.897,51.232; 4 10.897,53.772; 5 13.437,51.232; 6 13.437,53.772; 7 15.977,51.232; 8 15.977,53.772; 9 18.517,51.232; 10 18.517,53.772; 11 21.057,51.232; 12 21.057,53.772; 13 23.597,51.232; 14 23.597,53.772; 15 26.137,51.232; 16 26.137,53.772; 17 28.677,51.232; 18 28.677,53.772; 19 31.217,51.232; 20 31.217,53.772; 21 33.757,51.232; 22 33.757,53.772; 23 36.297,51.232; 24 36.297,53.772; 25 38.837,51.232; 26 38.837,53.772; 27 41.377,51.232; 28 41.377,53.772; 29 43.917,51.232; 30 43.917,53.772; 31 46.457,51.232; 32 46.457,53.772; 33 48.997,51.232; 34 48.997,53.772; 35 51.537,51.232; 36 51.537,53.772; 37 54.077,51.232; 38 54.077,53.772; 39 56.617,51.232; 40 56.617,53.772 | hole 2.75: 3.5,3.5; 61.5,3.5; 3.5,52.5; 61.5,52.5
XTAL_ECS-80-S-4X = drill 0.63 pad 1.03: 1 -2.44,0; 2 2.44,0

### Placement (x,y rotation side)
C1  25.91,62.99 180 bottom
C2  19.3,62.99 0 bottom
C3  33.66,45.59 0 top
C4  25.02,42.55 90 bottom
C5  30.99,65.02 270 bottom
C6  33.91,65.79 180 top
C7  3.78,11.81 90 top
C8  20.68,16.81 0 bottom
C9  20.35,23.11 180 bottom
C10  17.53,11.68 90 top
C11  30.23,34.29 90 top
C12  30.48,38.86 270 top
C13  42.42,29.59 270 bottom
C14  17.53,7.87 90 top
D1  30.86,42.93 90 top
D2  34.8,69.72 270 top
D3  6.4,45.67 270 top
D4  29.72,16.15 270 top
D5  66.4,69.44 270 top
J1  67.18,34.54 90 top
J2  19.56,28.19 0 top
J3  3.68,24.13 270 top
J4  34.29,58.93 270 top
J5  67.44,60.71 270 top
J6  37.21,42.55 180 top
J7  62.48,37.72 270 bottom
J8  3.68,33.91 270 top
J9  29.72,24.64 180 top
J10  40.26,65.79 0 top
J11  40.26,58.17 0 top
J12  7.77,49.25 90 top
J13  61.72,42.29 180 top
J14  43.56,42.29 180 top
J15  52.7,42.29 180 top
J16  62.1,12.06 270 top
J17  67.84,7.67 90 top
Q1  39.37,16.13 270 bottom
Q2  37.41,8.76 0 bottom
Q3  39.37,12.06 270 bottom
Q4  37.97,69.72 90 top
Q5  26.29,14.1 90 bottom
R1  26.54,42.55 270 top
R2  28.7,42.67 270 top
R3  37.72,61.59 0 bottom
R4  37.59,69.6 90 bottom
R5  32,69.72 90 top
R6  37.34,63.12 0 top
R7  37.34,65.15 180 top
R8  45.59,25.02 180 bottom
R9  43.94,22.61 0 bottom
R10  20.83,40.01 180 top
R11  23.75,60.33 270 top
R12  45.59,12.95 0 bottom
R13  35.43,12.19 90 bottom
R14  35.41,16.08 270 bottom
R15  45.72,17.02 0 bottom
R16  23.11,14.1 90 bottom
R17  26.52,17.02 180 bottom
R18  16.13,1.91 0 top
R19  21.72,60.33 270 top
R20  45.72,19.81 180 bottom
R21  16.13,4.19 0 top
R22  32.89,7.62 270 top
R23  24.08,6.99 90 bottom
R24  26.49,9.02 270 bottom
R25  41.63,7.75 0 bottom
R26  3.58,45.67 270 bottom
R27  61.7,70.31 180 top
U1  21.69,19.81 180 bottom
U2  24.89,36.45 90 top
U$1  20.83,56.9 270 top
U$2  33.53,67.18 180 bottom
U$4  33.02,40.13 270 top
U$5  38.35,39.5 270 top
U$6  38.81,4.93 0 top
U$7  25.4,7.62 180 top
U$8  65.02,3.81 90 top
Y1  22.61,65.02 0 top

### Tracks (layer width: path | path; a pad name or v marks a point on that pad's centre or on a via)
3V3  (via drill 0.35, 0.55)
  Top 0.508: v38.53,59 41.3,59 46.71,64.41 53.77,64.41 55.96,66.6 55.96,69.42 56.84,70.31 R27.2
  Top 0.762: U2.4 25.08,39.71 28.96,39.71 | 28.96,39.71 C12.1 31.84,39.71 | 28.96,39.71 28.7,39.97 R2.2 30.82,41.82 D1.C | 31.84,39.71 J6.2 32.8,44.41 C3.1 32.51,45.59 30.99,47.12 U$1.18 | 31.84,39.71 31.84,36.23 U$4.VIN U$5.VIN | v30.1,67.69 30.1,67.87 30.86,68.64 30.86,69.72 31.71,70.57 R5.2
  Top 0.813: J2.3 24.89,28.45 U2.2 U2.4
  Bottom 0.508: 36.87,59 v38.53,59
  Bottom 0.61: U$2.3 35.43,65.91 36.87,64.48 R3.2
  Bottom 0.762: J6.2 36.45,44.32 | 36.45,44.32 41.66,44.32 | 41.66,44.32 50.93,44.32 | 50.93,44.32 59.82,44.32 | J15.1 50.83,44.23 50.93,44.32 | J14.1 41.69,44.29 41.66,44.32 | 59.82,44.32 65.02,44.32 J1.4 68.71,40.64 68.71,33.02 68.58,32.89 63.63,32.89 62.48,34.04 J7.2 | J13.1 59.85,44.29 59.82,44.32 | U$5.VIN 40.35,32.51 C13.1 43.73,30.44 44.79,29.38 R8.1 R9.1 44.79,19.89 R20.1 R15.2 | Q1.1 44.81,17.08 R15.2 | R15.2 44.87,13.08 R12.2 | R12.2 40.43,12.95 Q3.1 | R12.2 44.74,10.01 R25.1 | U$2.3 33.49,65.87 C5.1 30.1,66.76 v30.1,67.69 32.85,70.45 R4.2 | R3.2 36.87,59 36.87,58.22 36.87,44.74 36.45,44.32
5V  (via drill 0.35, 0.55)
  Top 0.508: C10.1 20.76,10.83 U$7.10 24.08,10.79 | v33.55,16.94 31.8,16.94 31.75,16.89 | v24.08,9.53 24.08,10.79 | 24.08,10.79 26.54,10.79 | 28.45,20.78 28.37,20.78 26.42,18.82 v25.4,18.82
  Top 1.27: 28.45,20.78 30.18,20.78 31.75,19.2 31.75,16.89 | J2.4 J9.2 27.18,21.97 28.37,20.78 | R21.2 R18.2 16.98,1.69 v18.03,1.69 24.91,1.69 26.54,3.33 26.54,10.79 | 31.8,16.94 31.78,16.94 31.78,12.42
  Bottom 0.508: Q5.2 23.21,15.05 R16.2 22.29,14.95 21.53,15.71 C8.1 21.53,17.92 22.43,18.82 | 22.43,18.82 U1.8 v25.4,18.82 | R14.1 33.57,16.93 v33.55,16.94 | R13.1 32.73,11.34 v32.71,11.35 | 22.43,18.82 20.45,20.8 U1.4 19.5,20.81 C9.1 | R23.2 v24.08,9.53
  Bottom 0.762: v18.03,1.69 5.17,1.69 1.02,5.84 1.02,44.82 | J12.1 2.32,54.7 1.02,53.39 1.02,44.82 | R26.2 1.02,44.82
  pour Top: 25.1,8.15 25.1,13.16 33.99,13.16 33.99,8.15
  pour Top: 31.67,34.24 26.04,34.24 26.04,27.46 26.04,26.97 29.77,26.97 31.67,26.97
5V_RAW
  Top 0.406: 50.44,7.34 50.42,7.37 | J17.1 64.03,6.37
  Top 0.762: 62.1,4.45 64.03,6.37
  Top 1.524: 43.56,1.91 43.56,1.85 33.22,1.85
  Top 1.778: J16.1 J16.2 62.53,21.77 60.07,19.3 60.07,12.95 54.48,7.37 | 43.56,1.91 44.58,2.92 44.58,4.19 47.75,7.37 50.42,7.37 54.48,7.37 | 62.1,4.45 57.4,4.45 54.48,7.37
  pour Top: 27.76,7.11 27.76,0.81 33.99,0.81 33.99,7.11
!AMP_FAULT  (via drill 0.35)
  Top 0.254: v21.46,13.21 20.8,12.54 U$7.9
  Bottom 0.254: v21.46,13.21 21.5,13.25 R16.1 23.13,13.26 25.18,13.26 Q5.1
!AMP_RESET  (via drill 0.35)
  Top 0.203: v38.86,5.08 38.71,4.93 U$6.1
  Bottom 0.203: U$8.7 14.63,19.79 17.91,16.51 17.91,8.26 22.35,3.81 36.32,3.81 37.59,5.08 | 38.38,7.75 38.38,5.87 37.59,5.08 | 37.59,5.08 v38.86,5.08
  Bottom 0.254: R25.2 38.38,7.75 Q2.1
A_INT
  Bottom 0.203: U$8.26 9.14,40.54 9.14,35.05 10.41,33.78 16.26,33.78 19.94,30.1 29.97,30.1 34.29,34.42 47.37,34.42 48.64,33.15 48.64,28.07 49.28,27.43 U$4.AI1
AIN2  (via drill 0.35)
  Top 0.254: J2.2 22.1,24.94 21.21,24.05 18.16,24.05 17.35,23.24 v17.35,22.1
  Bottom 0.254: v17.35,22.1 17.35,21.11 18.31,20.14 U1.3
AMP_OUT  (via drill 0.35)
  Top 0.254: U$7.12 19.43,8.26 18.85,8.84 18.85,9.6 v18.87,9.63
  Bottom 0.254: v18.87,9.63 18.54,9.96 18.54,17.09 17.63,18.01 17.63,18.67 18.44,19.48 U1.2
CAN_H  (via drill 0.35)
  Top 0.254: v40.89,63.12 R6.2
  Bottom 0.254: J5.2 63.25,58.17 62.99,57.91 53.41,57.91 J11.2 J10.2 48.54,70.41 46.41,70.41 42.04,66.04 42.04,65.15 41.53,64.64 | 41.53,64.64 U$2.7 | v40.89,63.12 41.53,63.75 41.53,64.64
CAN_L  (via drill 0.35)
  Top 0.254: v41.15,65.91 41.15,65.41 40.89,65.15 R7.1
  Bottom 0.254: U$2.6 v41.15,65.91 46.1,70.87 50.08,70.87 J10.3 J11.3 54.91,58.42 62.48,58.42 65.46,61.39 66.75,61.39 J5.1
CAN_RESET
  Top 0.203: R10.2 19.18,39.2 19.18,33.66 15.47,29.95 U$8.15
CAN_SILENT
  Bottom 0.254: U$2.8 38.57,63.01 R3.1
CAN_TERM_COM
  Top 0.203: 36.61,65.02 36.53,65.11 R7.2
  Top 0.254: C6.1 35.85,65.79 36.53,65.11 | 36.61,65.02 R7.2 R6.1
CLK
  Top 0.203: U$8.23 15.14,40.11 15.75,40.72 15.75,46.35 16.21,46.81 17.4,46.81 17.93,46.28 17.93,44.27 18.47,43.74 19.36,43.74 21.36,45.74 24.13,45.74 24.64,46.25 U$1.13 24.64,48.87 30.18,54.41 31.37,54.41 32.16,55.19 32.16,55.8 32.74,56.39 J4.2
CS  (via drill 0.35)
  Top 0.203: v19.89,41.35 21.16,41.35 24.08,44.27 26.74,44.27 28.49,46.02 28.49,47.45 U$1.16 28.45,49.96 30.02,51.54 32,51.54 32.69,50.85 32.69,49.58 33.5,48.77 J4.5
  Bottom 0.203: v19.89,41.35 18.59,42.65 17.32,42.65 16.08,41.4 12.55,41.4 U$8.24
DI1
  Top 0.254: U$8.36 9.55,55.35 5.54,59.36 J12.2
DI2
  Top 0.254: U$8.38 9.35,57.89 5.87,61.37 4.99,61.37 J12.3
FAULT  (via drill 0.35)
  Top 0.254: v37.08,67.18 38.67,68.77 Q4.1
  Bottom 0.254: U$2.5 v37.08,67.18 37.08,68.24 R4.1
GND  (via drill 0.35)
  Top 0.406: 23.37,23.11 24.77,23.11 25.6,22.28 25.6,21.64 v26.34,20.9 | 53.9,5.04 54.24,4.7 | J17.5 63.67,8.97 63.25,9.4 | J17.5 65.19,9.75 J17.SHLD@6 | J17.5 67.67,8.97 J17.SHLD@2
  Top 0.762: 9.27,17.53 9.55,17.25 | U$8.9 15.85,22.33 v15.88,22.35 | v13.72,62.61 13.72,60.5 13.77,60.45 v15.75,60.45 | v8.76,17.27 11.23,17.27 U$8.6 | U$8.34 8.15,52.81 v8.13,52.83
  Bottom 0.406: U1.7 22.99,19.48 21.72,20.75 v21.72,21.41
  Bottom 0.762: v15.88,22.35 13.82,22.35 U$8.9 | v13.72,62.61 13.79,62.53 U$8.39 13.82,60.45 v15.75,60.45 | U$8.6 8.79,17.25 v8.76,17.27 | v8.13,52.83 11.23,52.83 U$8.34
  other vias: 7.62,5.31 0.79,2.74 15.65,10.08 22.66,9.5 23.06,11.76 20.29,14.73 15.93,23.29 17.3,29.62 17.02,44.93 23.6,53.9 27.51,59.99 17.63,59.87 45.75,67.08 45.09,60.73 60.73,60.71 3.23,26.54 6.43,23.01 8.08,12.98 58.75,7.47 66.85,10.21 63.91,10.72 57.43,12.9 55.93,16.03 66.93,27.76 60.66,31.09 54.41,29.82 56.41,35.94 51.16,34.01 57.25,41.33 32.77,30.1 42.32,18.87 54.38,26.52 18.26,57.91 15.93,56.52 16.94,52.53 16.97,49.61 43.13,32.72 2.44,1.73 3.58,12.01 7.65,6.43 15.6,16.71 16.23,13.79 41.68,9.6 35.08,8.84 54.76,21.82 17.93,35.71 22.89,36.47 28.47,37.74 28.35,35.59 48.23,38.66 58.83,38.66 7.8,63.63 7.82,67.82 28.47,15.19 23.62,16.99 66.8,65.33 68.43,44.25 46.81,22.58 41.58,14.17 37.41,14.05 8.69,32.05 32.77,27.89 49.38,14.33 16.36,37.8 19.35,45.87 60.6,26.34 35.81,39.07 41,38.33 43.33,35.51 46.74,35.46
  pour Top (isolate 0.406, rank 5): -8.64,74.8 73.15,74.8 73.15,-2.03 -8.64,-2.03
  pour Bottom (isolate 0.406, rank 5): -6.6,75.69 74.8,75.69 74.8,-2.41 -6.6,-2.41
  pour Bottom: 62.86,18.41 68.07,18.41 68.07,13.84 62.86,13.84
IMU_INT  (via drill 0.35)
  Top 0.203: U$5.INT 55.5,24.89 52.96,22.35 U$4.GI1 48.89,24.26 48.89,26.42 47.7,27.61 42.95,27.61 41.48,26.14 34.85,26.14 v32.92,24.21
  Bottom 0.203: U$8.13 15.67,25.53 21.34,25.53 23.62,23.24 31.95,23.24 v32.92,24.21
IMU_RESET
  Top 0.203: U$5.RST U$4.RST
  Bottom 0.203: U$8.11 13.82,24.89 21.21,24.89 23.11,22.99 23.11,22.1 23.88,21.34 24.77,21.34 25.71,22.28 31.32,22.28 33.78,19.81 U$4.RST
INT
  Top 0.203: U$1.12 23.37,50.67 16.13,57.91 13.82,57.91 U$8.37
MISO
  Top 0.203: U$8.21 15.39,35.97 16.74,35.97 17.58,36.8 17.58,40.18 22.1,44.7 25.78,44.7 27.18,46.1 U$1.15 27.18,49.61 30.12,52.55 35.66,52.55 36.02,52.2 36.02,51.61 35.71,51.31 J4.4
MOSI
  Top 0.203: U$8.19 12.52,36.3 12.52,38.23 13.13,38.84 15.34,38.84 21.72,45.21 25.02,45.21 25.91,46.1 U$1.14 25.91,49.23 29.72,53.03 32.05,53.03 32.59,53.57 32.59,54.69 33.02,55.12 33.81,55.12 34.29,54.63 J4.3
N$1
  Bottom 0.203: R20.2 54.86,19.81 U$5.ADR
N$2  (via drill 0.35)
  Top 0.254: v25.02,61.72 24.47,61.17 R11.1
  Bottom 0.254: Y1.2 25.05,63 C1.1 25.06,61.76 v25.02,61.72
N$3  (via drill 0.35)
  Top 0.254: v20.19,61.72 20.74,61.17 R19.1
  Bottom 0.254: Y1.1 20.17,63 C2.1 20.15,61.76 v20.19,61.72
N$6
  Top 0.254: C14.1 20.76,7.02 U$7.13
N$7
  Top 0.762: D2.C 35.82,70.77 Q4.3
N$8
  Top 0.762: R5.1 34.55,68.87 D2.A
N$9  (via drill 0.35)
  Top 0.254: v5.13,46.53 6.39,46.53 D3.A
  Bottom 0.254: R26.1 5.12,46.52 v5.13,46.53
N$10
  Bottom 0.254: Q5.3 27.37,14.12 R17.2
N$11  (via drill 0.35)
  Top 0.254: v28.4,18.49 29.24,18.49 29.72,18.01 D4.A
  Bottom 0.254: R17.1 25.67,17.79 26.37,18.49 v28.4,18.49
N$12
  Top 0.254: R27.1 66.38,70.31 D5.A
N$13
  Bottom 0.254: Q2.3 R24.1
OCD  (via drill 0.35)
  Top 0.254: U$7.16 23.88,3.17 24.11,3.4 v24.11,4.62
  Bottom 0.254: R24.2 26.49,7.02 25.26,5.79 24.08,5.79 R23.1 24.11,6.11 v24.11,4.62
OSC1
  Top 0.254: R19.2 22.1,59.09 U$1.8
OSC2
  Top 0.254: R11.2 23.37,59.09 U$1.7
PI_POWER
  Top 1.27: R21.1 R18.1
  Top 1.778: U$8.4 U$8.2 7.68,8.59 C7.+ 3.79,4.6 5.56,2.82 13.33,2.82
  pour Top: 12.95,5.21 16,5.21 16,0 12.95,0
PWM
  Bottom 0.203: J9.3 22.99,26.29 17.27,26.29 14.86,28.7 9.65,28.7 7.49,30.86 7.49,48.9 10.03,51.44 12.57,51.44 13.79,52.65 U$8.33
RESET
  Top 0.203: R1.1 28.23,45.09 28.58,45.09 29.72,46.23 U$1.17
RESET_MID  (via drill 0.35)
  Top 0.406: D1.A 29.26,44.08 R2.1 28.57,43.52 26.79,41.7 R1.2 26.19,41.66 v23.75,41.66 23.33,41.66 R10.1
  Bottom 0.406: v23.75,41.66 23.79,41.7 C4.1
RX
  Top 0.203: J8.2 9.02,26.04 9.02,23.62 10.31,22.33 U$8.10
RX0_INT
  Top 0.203: U$1.11 22.1,49.53 16.28,55.35 U$8.35
RX1_INT
  Top 0.203: U$1.10 14.02,47.5 U$8.29
RXCAN  (via drill 0.35)
  Top 0.203: 29.72,65.53 v31.37,67.18
  Top 0.254: 29.72,65.53 29.72,63.8 32.41,61.11 32.41,59.94 31.88,59.41 30.76,59.41 29.72,58.37 U$1.2
  Bottom 0.203: v31.37,67.18 U$2.4
SCL  (via drill 0.35)
  Top 0.254: v25.91,26.42 24.38,26.42 21.34,23.37 21.34,22.61 20.57,21.84 18.92,21.84 14.33,17.25 U$8.5 | v42.88,15.19 46.51,15.19 48.92,12.78 50.55,12.78 51.51,13.74 51.51,14.83 50.6,15.75 v47.52,15.75 | v46.23,18.47 44.07,18.47 v43.08,19.46 | v43.71,28.57 43.71,29.36 45.31,30.96 45.31,37.31 42.62,40.01 42.62,41.98 J14.2 44.33,43.69 51.36,43.69 | 51.36,43.69 52.09,42.95 52.09,42.31 J15.2 | 51.36,43.69 60.43,43.69 | J13.2 61.1,43.02 60.43,43.69 | 60.43,43.69 64.08,43.69 65.58,42.19 65.58,38.56 67.06,37.08 J1.2
  Bottom 0.254: R9.2 43.05,22.57 43.08,22.54 v43.08,19.46 | v25.91,26.42 34.04,26.42 U$4.SCL 37.08,24.89 U$5.SCL 41,22.35 41.25,22.61 R9.2 | U$8.5 13.23,17.25 11.94,18.54 6.73,18.54 J3.2 | Q1.2 v42.86,15.18 v42.88,15.19 | v46.23,18.47 46.57,18.12 R15.1 46.57,16.7 v47.52,15.75 | v43.71,28.57 43.71,26.92 43.09,26.3 R9.2
SCL_ADC
  Bottom 0.254: U1.5 25.15,20.8 26.19,21.84 30.68,21.84 32.61,19.91 32.61,15.93 33.31,15.23 R14.2 36.44,15.23 37.34,16.13 Q1.3
SDA  (via drill 0.35)
  Top 0.254: v24.13,22.23 19.94,18.03 18.54,18.03 15.21,14.71 U$8.3 12.57,15.93 12.57,17.78 11.81,18.54 4.19,18.54 J3.3 | U$4.SDA 38.1,24.89 U$5.SDA v48.13,24.89 | v43.05,11.1 v45.82,11.1 | v48.46,18.09 v48.46,20.93 | v46.43,32.69 48.36,34.62 48.36,35.64 43.79,40.21 43.79,41.9 J14.3 45.05,43.16 47.52,43.16 49.45,41.22 52.26,41.22 J15.3 54.27,43.23 56.49,43.23 58.45,41.27 | 58.45,41.27 61.33,41.27 J13.3 | v62.31,39.6 60.12,39.6 58.45,41.27
  Bottom 0.254: R8.2 46.48,25.02 48.46,23.04 v48.46,20.93 | v24.13,22.23 24.64,22.73 31.88,22.73 33.4,21.21 35.05,21.21 35.56,21.72 U$4.SDA | Q3.2 43.04,11.12 v43.05,11.1 | v45.82,11.1 46.48,11.76 46.48,12.91 R12.1 48.46,14.97 v48.46,18.09 | v48.13,24.89 46.57,24.89 R8.2 | R8.2 46.44,28.05 47.45,29.06 47.45,30.28 46.43,31.29 v46.43,32.69 | v62.31,39.6 67.16,39.6 J1.3
SDA_ADC
  Bottom 0.254: Q3.3 37.36,12.06 36.39,13.04 R13.2 33.97,14.5 30.58,14.5 30.02,15.06 30.02,18.69 29.49,19.23 27.56,19.23 26.64,20.14 U1.6
TX
  Top 0.203: J8.3 8.13,24.38 8.13,21.84 10.18,19.79 U$8.8
TXCAN  (via drill 0.35)
  Top 0.254: U$1.1 30.99,55.6 30.43,55.04 v28.96,55.04
  Bottom 0.254: v28.96,55.04 28.47,55.04 27.81,55.7 27.81,58.98 32.21,63.37 U$2.1

### Text on the board
tNames: CAN FAULT LED | 3.3V LED | CAN_H - CAN_L | CAN_H - CAN_L | 5V - DI1 - DI2 - GND | 5V LED | CS - MISO - MOSI - CLK - GND | 3.3V - SCL - SDA - GND | 3.3V - GND | FXOS8700 / FXAS21002 | BNO055 | <<< | <<< | 3.3V - GND | GND - SCL - SDA - 3.3V | TX - RX - GND | PWM - 5V - GND | SDA - SCL - GND | ROV X13 Pi Shield v1 / Conner Swift / Katherine Sandys / Grant Geyer / 1-11-2021 | Overcurrent Fault | GND - GND - NC - 5V - 5V